# Altium schematic sheet [CC2538] Flashing - FTDI.SchDoc
size 254 x 208 mm
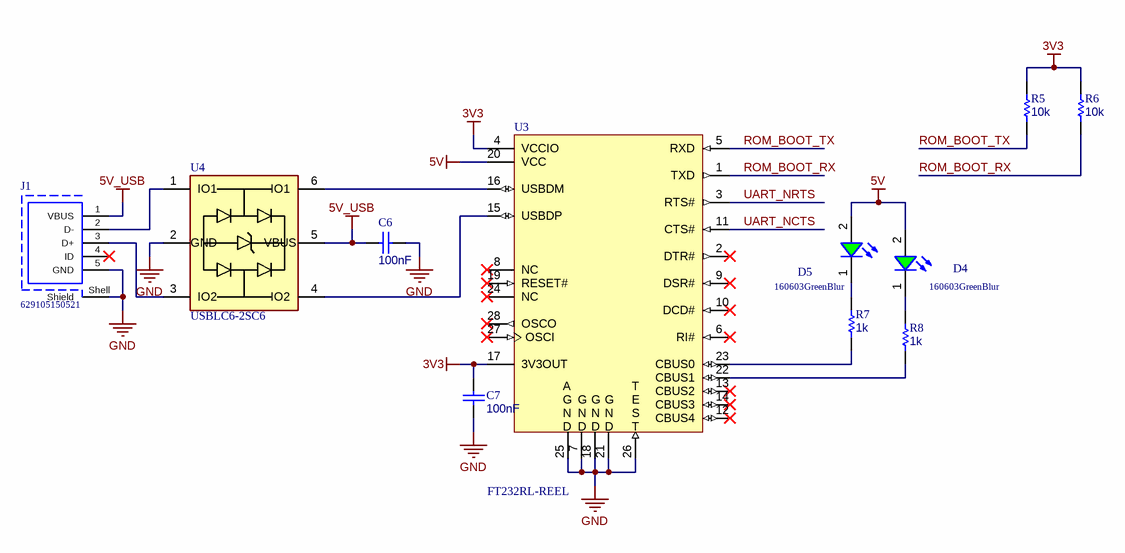
[diagram p0: [CC2538] Flashing - FTDI.SchDoc]

## Parts
C6  value 100nF  [CAP_0603]  (hidden comment: 0106031041050)
C7  value 100nF  [CAP_0603]  (hidden comment: 0106031041050)
D4  160603GreenBlur  [WL-SMCW_0603_H=0.7mm]
D5  160603GreenBlur  [WL-SMCW_0603_H=0.7mm]
J1  629105150521  [629105150521]
R5  value 10k  [RES_0603]  (hidden comment: 0006031031)
R6  value 10k  [RES_0603]  (hidden comment: 0006031031)
R7  value 1k  [RES_0603]  (hidden comment: 0006031021)
R8  value 1k  [RES_0603]  (hidden comment: 0006031021)
U3  FT232RL-REEL  [FTDI-SSOP-28_L]
U4  USBLC6-2SC6  [USBLC6-2SC6-Footprint-1]

## Nets
3V3: C7.2 R5.2 R6.2 U3.4(VCCIO) U3.17(3V3OUT)
5V: D4.2(A) D5.2(A) U3.20(VCC)
5V_USB: C6.2 J1.1(VBUS) U4.5(VBUS)
GND: C6.1 C7.1 J1.5(GND) J1.Shell(Shield) U3.7(GND) U3.18(GND) U3.21(GND) U3.25(AGND) U3.26(TEST) U4.2(GND)
ROM_BOOT_RX: R6.1 U3.1(TXD)
ROM_BOOT_TX: R5.1 U3.5(RXD)
UART_NCTS: U3.11(CTS#)
UART_NRTS: U3.3(RTS#)
NetD4_1: D4.1(K) R8.2
NetD5_1: D5.1(K) R7.2
NetJ1_2: J1.2(D-) U4.1(IO1)
NetJ1_3: J1.3(D+) U4.3(IO2)
NetR7_1: R7.1 U3.23(CBUS0)
NetR8_1: R8.1 U3.22(CBUS1)
NetU3_15: U3.15(USBDP) U4.4(IO2)
NetU3_16: U3.16(USBDM) U4.6(IO1)

Not connected (* = marked no-connect by the designer): J1 4(ID)*; U3 2(DTR#)* 6(RI#)* 8(NC)* 9(DSR#)* 10(DCD#)* 12(CBUS4)* 13(CBUS2)* 14(CBUS3)* 19(RESET#)* 24(NC)* 27(OSCI)* 28(OSCO)*

## Notes on the sheet
- Title
- Size
- Date:
- A4
- Number
- Check by:
- Revision
- Sheet of:
- Draw by:
- (in symbol CMP-015-00000-6) A / G / N / D; G / N / D; T / E / S / T

## Library data of the parts
C6 C7 = CMP-001-00176-2: CAP, size 0603, 100 nF, 50 VDC, 10%; Manufacturer Part Number: CGA3E3X8R1H104K080AE; Manufacturer: TDK; Voltage Rating DC: 50 VDC; Source: Capacitor_0603_10_percent.SchLib; Operating Temperature Min: - 40 C; Supplier 3 URL: https://www.thegioiic.com/tu-gom-0603-100nf-0-1uf-50v; Supplier 1 Part Number: 810-CGA3E3X8R1H104KA; Mount: SMD/SMT; Supplier 1 URL: https://www.mouser.com/ProductDetail/TDK/CGA3E3X8R1H104K080AE?qs=nQSIdc08i%252Bd8g3IRRgU2bw%3D%3D&utm_source=mouser-refine-download&utm_medium=file&utm_campaign=CGA3E3X8R1H104K080AE&utm_content=TDK; Packaging: Tape and Reel; Supplier 3 Part Number: N/A; LCSC Part #: C14663; ComponentLink1Description: Datasheet; Operating Temperature Max: + 85 C; Design Item ID: 0106031041050; Supplier 2 URL: https://www.digikey.com/en/products/detail/tdk-corporation/cga3e3x8r1h104k080ae/5809262; Component Type: Standard; Supplier 2 Part Number: 445-173697-2-ND; Case/Package: 0603; Tolerance: 10%; ComponentLink1URL: https://product.tdk.com/system/files/dam/doc/product/capacitor/ceramic/mlcc/catalog/mlcc_automotive_soft_en.pdf?ref_disty=mouser; Pins: 2
D4 D5 = CMP-004-00033-2: WL-SMCW SMT Mono-color Chip LED Blur, size 0603, Green, 3.2V, 140deg; ComponentLink1URL: N/A; ComponentLink4Description: Supplier 3 URL; Value: Green, 3.2V; ComponentLink2Description: Supplier 1 URL; Supplier 1 Name: Mouser; Supplier 1 SN: 755-SMLD12EN1WT86; Supplier 3 URL: N/A; Design Item ID: 160603GreenBlur; Supplier 3 Name: ICDayRoi; ComponentLink4URL: N/A; Color: Green; Pins: 2; Supplier 1 URL: https://www.mouser.vn/ProductDetail/ROHM-Semiconductor/SMLD12EN1WT86?qs=qSfuJ%252Bfl%2Fd4fR%252B9yZydIwg%3D%3D; Size: 0603; ComponentLink3Description: Supplier 2 URL; Type: Blur; Supplier 2 Name: Digi-Key; Supplier 2 SN: 511-1578-2-ND; Component Type: Standard; ComponentLink3URL: https://www.digikey.com/en/products/detail/rohm-semiconductor/SML-D12M8WT86/1641797; ComponentLink2URL: https://www.mouser.vn/ProductDetail/ROHM-Semiconductor/SMLD12EN1WT86?qs=qSfuJ%252Bfl%2Fd4fR%252B9yZydIwg%3D%3D; Source: WL-SMCW_0603.SchLib; Supplier 3 SN: N/A; Supplier 2 URL: https://www.digikey.com/en/products/detail/rohm-semiconductor/SML-D12M8WT86/1641797; ComponentLink1Description: Datasheet link
J1 = CMP-002-00305-5: Micro USB 2.0 Type B Receptacle WR-COM, Horizontal, SMT, with Pegs, High Current at Pin 1 & Pin 5
R5 R6 = CMP-009-00187-4: RES, size 0603, 10 KOhm, 1/10 W, 1%; Manufacturer Part Number: RC0603FR-0710KL; Manufacturer: YAGEO; Rated Power: 1/10 W; Source: Resistor_0603.SchLib; Pins: 2; Case/Package: 0603; Packaging: Tape and Reel; ComponentLink1Description: Datasheet; Component Type: Standard; Supplier 1 URL: N/A; Design Item ID: 0006031031; Supplier 2 Part Number: 311-10.0KHRTR-ND; Supplier 2 URL: https://www.digikey.com/en/products/detail/yageo/rc0603fr-0710kl/726880; Operating Temperature Max: + 85 C; Mount: SMD/SMT; Supplier 3 URL: N/A; Supplier 1 Part Number: N/A; Operating Temperature Min: - 40 C; LCSC Part #: C98220; Supplier 3 Part Number: N/A; ComponentLink1URL: https://fscdn.rohm.com/en/products/databook/datasheet/passive/resistor/chip_resistor/esr-e.pdf; Tolerance: 1%
R7 R8 = CMP-009-00185-4: RES, size 0603, 1 KOhm, 1/10 W, 1%; Manufacturer Part Number: RC0603FR-071KL; Manufacturer: YAGEO; Rated Power: 1/10 W; Tolerance: 1%; Supplier 1 URL: https://www.mouser.vn/ProductDetail/YAGEO/RC0603FR-071KL?qs=VU8sRB4EgwApHsk4rF%2F3zg%3D%3D; ComponentLink1URL: https://www.yageo.com/upload/media/product/productsearch/datasheet/rchip/PYu-SR_20105_RoHS_L_10.pdf; Supplier 3 URL: N/A; Case/Package: 0603; Supplier 2 URL: https://www.digikey.com/en/products/detail/yageo/rc0603fr-071kl/726843; Mount: SMD/SMT; Supplier 2 Part Number: 311-1.00KHRTR-ND; Source: Resistor_0603.SchLib; Packaging: Tape and Reel; Component Type: Standard; Design Item ID: 0006031021; ComponentLink1Description: Datasheet; Operating Temperature Max: + 85 C; Supplier 3 Part Number: N/A; Operating Temperature Min: - 40 C; LCSC Part #: C22548; Supplier 1 Part Number: 603-RC0603FR-071KL; Pins: 2
U3 = CMP-015-00000-6: USB UART IC, -0.5 to 6 V, 24 mA, -40 to 85 degC, 28-Pin SSOP, RoHS, Tape and Reel; Manufacturer: Future Technology Devices International (FTDI); Nominal Supply Voltage: 5V; Max Supply Voltage: 5.25V; Min Supply Voltage: 3.3V; Channels: 1; Data Rate: 3Mbps; Max Operating Temperature: 85°C; Pins: 16; Locally Supplier URL: https://www.thegioiic.com/ft232rl-ic-usb-to-serial-uart-28-ssop; RoHS Compliant: True; Packaging: TapeandReel; Min Operating Temperature: -40°C; Interface: UART; Datasheet Version: Rev. 1.04, 02/2006; Locally Supplier Name: Thegioiic; Case/Package: SSOP; Manufacturer URL: http://www.ftdichip.com/; Package Quantity: 2000; Datasheet URL: http://datasheet.octopart.com/FT232RL-FTDI-datasheet-120501.pdf
U4 = CMP-004-00055-2: 17V Clamp 5A (8/20Âµs) Ipp Tvs Diode Surface Mount SOT-23-6